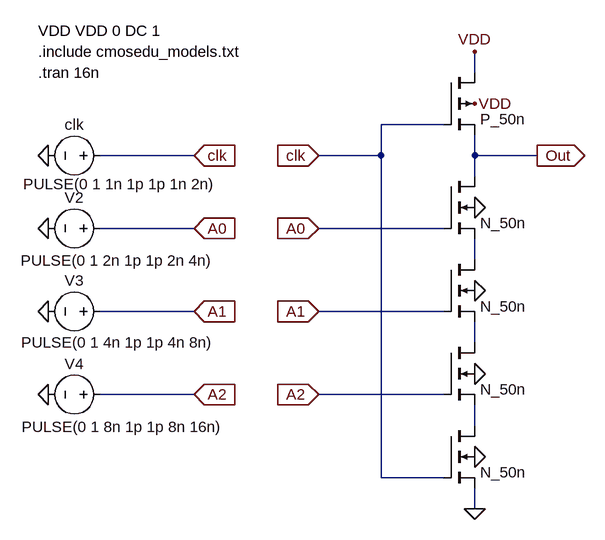
[diagram p0: schematic Draft1.asc]
Draft1.asc, the LTspice schematic file:
Version 4
SHEET 1 880 680
WIRE 256 -112 256 -144
WIRE 208 -32 112 -32
WIRE -176 16 -320 16
WIRE 112 16 112 -32
WIRE 112 16 16 16
WIRE 256 16 256 -16
WIRE 352 16 256 16
WIRE 256 48 256 16
WIRE -176 128 -320 128
WIRE 208 128 16 128
WIRE 256 176 256 144
WIRE -176 256 -320 256
WIRE 208 256 16 256
WIRE 256 304 256 272
WIRE -176 384 -320 384
WIRE 208 384 16 384
WIRE 256 432 256 400
WIRE 112 512 112 16
WIRE 208 512 112 512
WIRE 256 560 256 528
FLAG 256 96 0
FLAG 256 224 0
FLAG 256 352 0
FLAG 256 480 0
FLAG 256 560 0
FLAG 256 -144 VDD
FLAG 16 384 A2
IOPIN 16 384 In
FLAG 16 256 A1
IOPIN 16 256 In
FLAG 16 128 A0
IOPIN 16 128 In
FLAG 352 16 Out
IOPIN 352 16 Out
FLAG 256 -64 VDD
FLAG 16 16 clk
IOPIN 16 16 In
FLAG -176 16 clk
IOPIN -176 16 In
FLAG -400 16 0
FLAG -400 128 0
FLAG -400 256 0
FLAG -400 384 0
FLAG -176 128 A0
IOPIN -176 128 In
FLAG -176 256 A1
IOPIN -176 256 In
FLAG -176 384 A2
IOPIN -176 384 In
SYMBOL nmos4 208 48 R0
WINDOW 0 56 32 Invisible 2
SYMATTR InstName M1
SYMATTR Value N_50n
SYMATTR Value2 l=50n w=500n
SYMBOL nmos4 208 176 R0
WINDOW 0 56 32 Invisible 2
SYMATTR InstName M2
SYMATTR Value N_50n
SYMATTR Value2 l=50n w=500n
SYMBOL nmos4 208 304 R0
WINDOW 0 56 32 Invisible 2
SYMATTR InstName M3
SYMATTR Value N_50n
SYMATTR Value2 l=50n w=500n
SYMBOL nmos4 208 432 R0
WINDOW 0 56 32 Invisible 2
SYMATTR InstName M4
SYMATTR Value N_50n
SYMATTR Value2 l=50n w=500n
SYMBOL pmos4 208 -112 R0
WINDOW 0 56 32 Invisible 2
SYMATTR InstName M5
SYMATTR Value P_50n
SYMATTR Value2 l=50n w=1u
SYMBOL voltage -304 16 R90
WINDOW 0 -32 56 VBottom 2
WINDOW 3 28 -14 VTop 2
WINDOW 123 0 0 Left 0
WINDOW 39 0 0 Left 0
SYMATTR InstName clk
SYMATTR Value PULSE(0 1 1n 1p 1p 1n 2n)
SYMBOL voltage -304 128 R90
WINDOW 0 -32 56 VBottom 2
WINDOW 3 34 -10 VTop 2
WINDOW 123 0 0 Left 0
WINDOW 39 0 0 Left 0
SYMATTR InstName V2
SYMATTR Value PULSE(0 1 2n 1p 1p 2n 4n)
SYMBOL voltage -304 256 R90
WINDOW 0 -32 56 VBottom 2
WINDOW 3 32 -11 VTop 2
WINDOW 123 0 0 Left 0
WINDOW 39 0 0 Left 0
SYMATTR InstName V3
SYMATTR Value PULSE(0 1 4n 1p 1p 4n 8n)
SYMBOL voltage -304 384 R90
WINDOW 0 -32 56 VBottom 2
WINDOW 3 34 -18 VTop 2
WINDOW 123 0 0 Left 0
WINDOW 39 0 0 Left 0
SYMATTR InstName V4
SYMATTR Value PULSE(0 1 8n 1p 1p 8n 16n)
TEXT -416 -176 Left 2 !VDD VDD 0 DC 1
TEXT -416 -144 Left 2 !.include cmosedu_models.txt
TEXT -416 -112 Left 2 !.tran 16n

The netlist it stands for:
* Draft1.asc
M1 Out A0 N001 0 N_50n l=50n w=500n
M2 N001 A1 N002 0 N_50n l=50n w=500n
M3 N002 A2 N003 0 N_50n l=50n w=500n
M4 N003 clk 0 0 N_50n l=50n w=500n
M5 VDD clk Out VDD P_50n l=50n w=1u
V§clk clk 0 PULSE(0 1 1n 1p 1p 1n 2n)
V2 A0 0 PULSE(0 1 2n 1p 1p 2n 4n)
V3 A1 0 PULSE(0 1 4n 1p 1p 4n 8n)
V4 A2 0 PULSE(0 1 8n 1p 1p 8n 16n)
.model NMOS NMOS
.model PMOS PMOS
.lib standard.mos
VDD VDD 0 DC 1
.include cmosedu_models.txt
.tran 16n
.backanno
.end

* Results of the author's LTspice run, read from the files saved beside the schematic
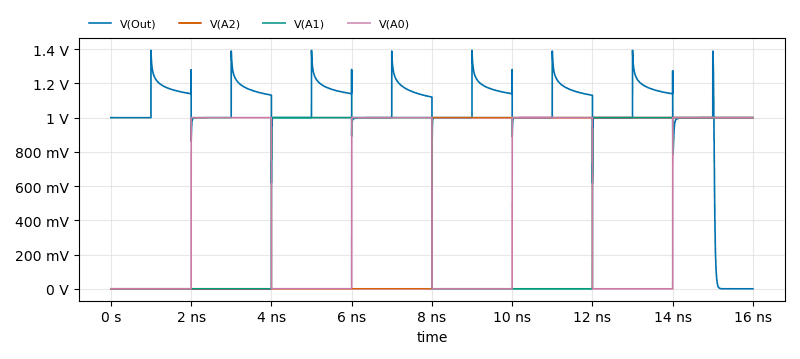
[diagram p1: Transient Analysis of Draft1.asc, plotted from the saved traces]
* Transient Analysis, 1 run:
*   V(Out): min 88.53 µV, max 1.393 V, average 1.017 V, rms 1.052 V, last 88.87 µV
*   V(A2): min 0 V, max 1 V, average 500 mV, rms 707.1 mV, last 1 V
*   V(A1): min 0 V, max 1 V, average 500 mV, rms 707.1 mV, last 1 V
*   V(A0): min 0 V, max 1 V, average 500.2 mV, rms 707.2 mV, last 1 V